# EAGLE design OpenEVSE_PLUS_v6.5.1 (EAGLE 9.6.2)
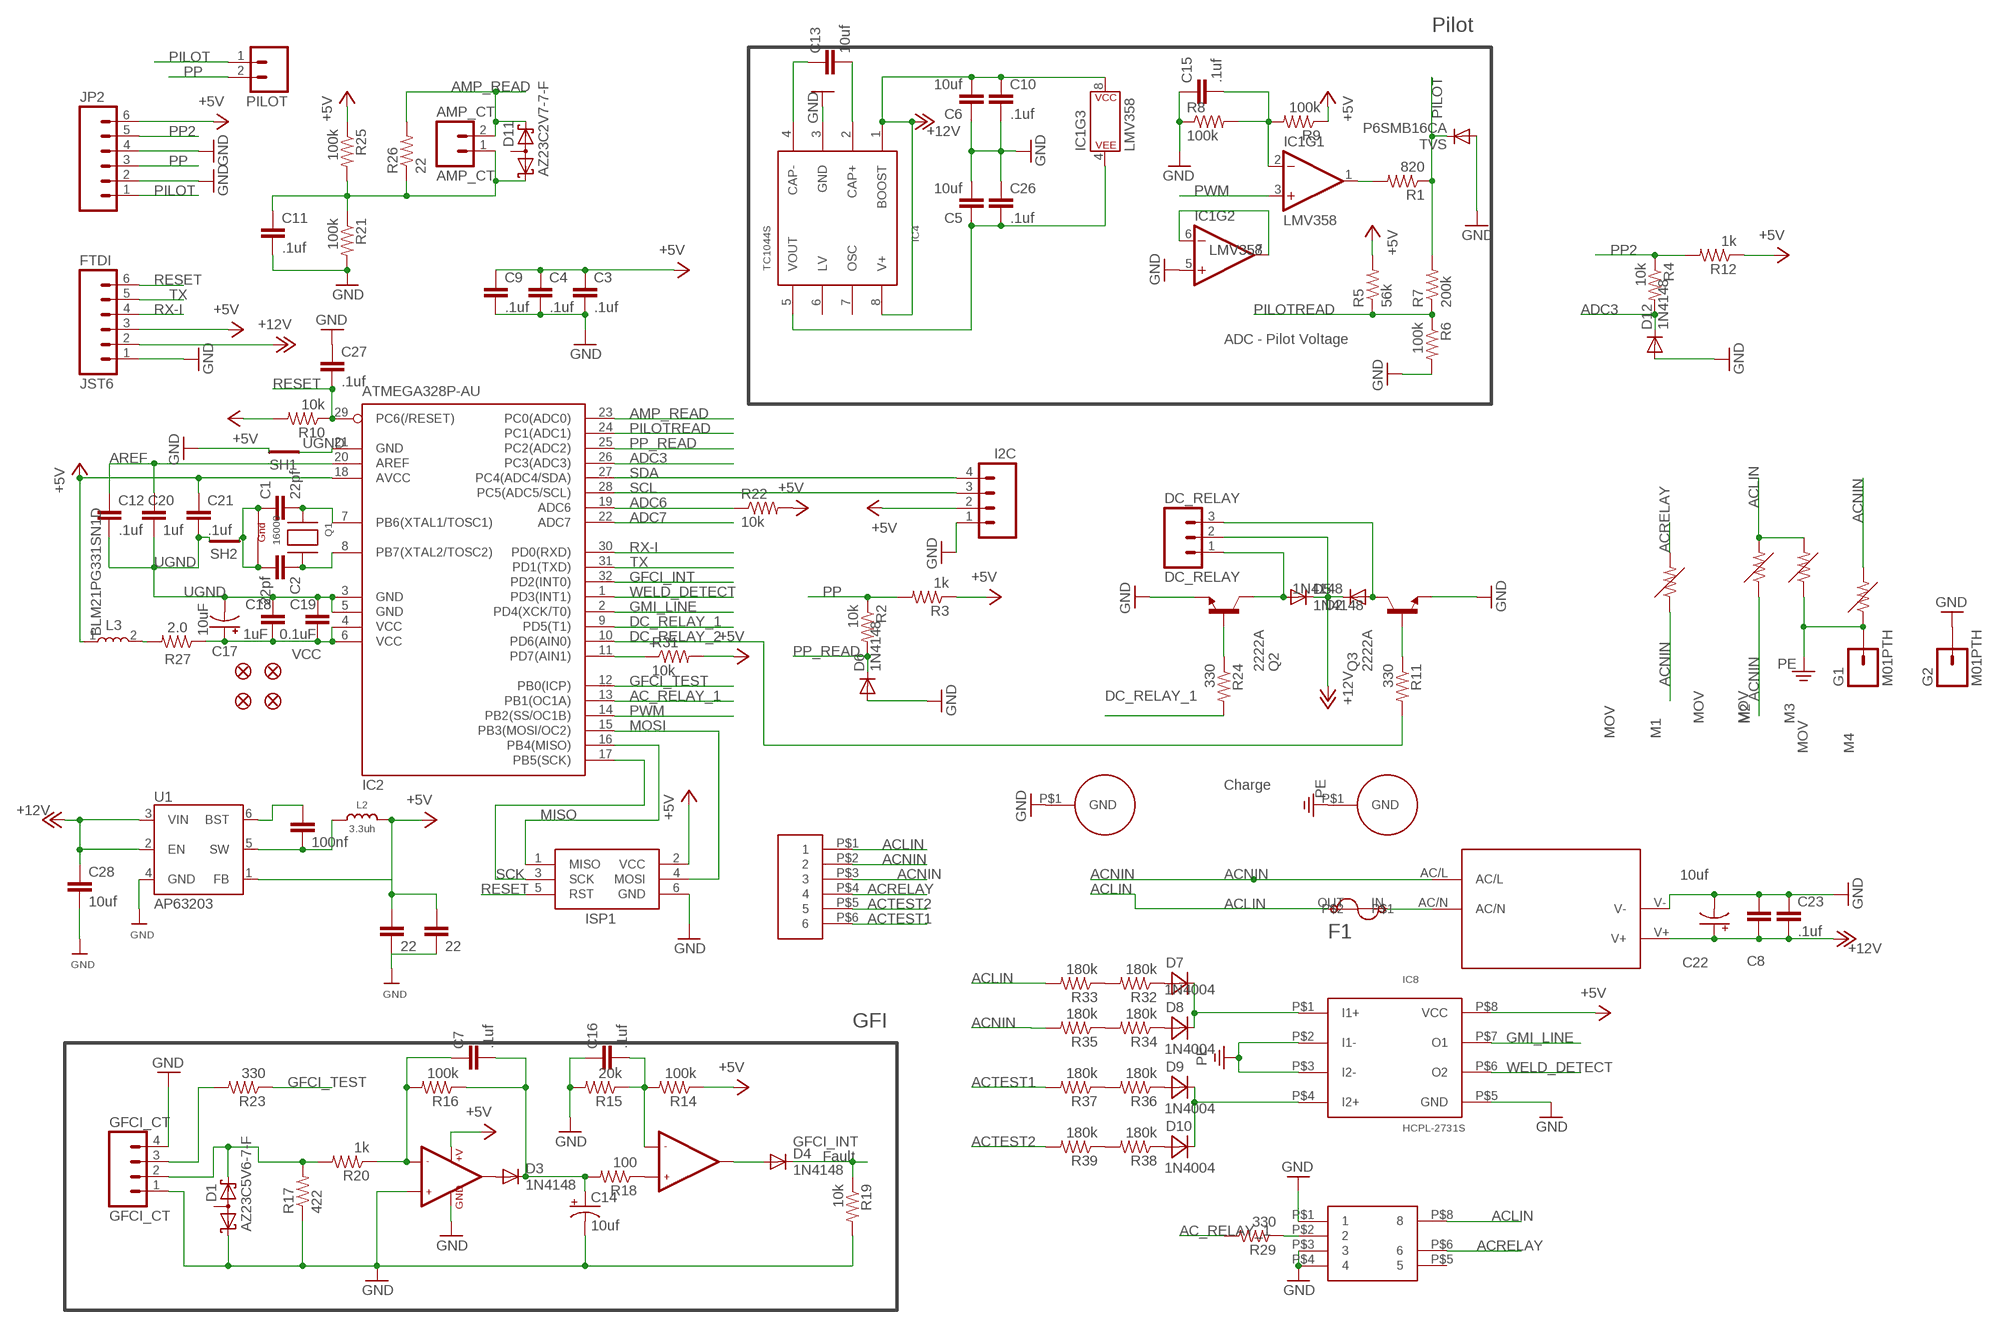
[diagram p0: schematic, sheet 1]

## Parts
AC  JST-VH-6  [JST-VH-6]
AMP_CT  AMP_CT  MOLEX_2  [MOLEX_2]
C1  22pf  CAP0805  [0805]
C2  22pf  CAP0805  [0805]
C3  .1uf  CAP0805  [0805]
C4  .1uf  CAP0805  [0805]
C5  10uf  CAP0805  [0805]
C6  10uf  CAP0805  [0805]
C7  .1uf  CAP0805  [0805]
C8  1uf  CAP0805  [0805]
C9  .1uf  CAP0805  [0805]
C10  .1uf  CAP0805  [0805]
C11  .1uf  CAP0805  [0805]
C12  .1uf  CAP0805  [0805]
C13  10uf  CAP0805  [0805]
C14  10uf  CAP_POL1206  [EIA3216]
C15  .1uf  CAP0805  [0805]
C16  .1uf  CAP0805  [0805]
C17  10uF  10UF-POLAR-0603-6.3V-20%(TANT)  [0603-POLAR]
C18  1uF  CAP0805  [0805]
C19  0.1uF  CAP0805  [0805]
C20  1uf  CAP0805  [0805]
C21  .1uf  CAP0805  [0805]
C22  10uf  CAP_POL1206  [EIA3216]
C23  .1uf  CAP0805  [0805]
C26  .1uf  CAP0805  [0805]
C27  .1uf  CAP0805  [0805]
C28  10uf  1.0UF-0805-25V-(+80/-20%)  [0805]
C29  22  1.0UF-0805-25V-(+80/-20%)  [0805]
C32  100nf  1.0UF-0805-25V-(+80/-20%)  [0805]
C33  22  1.0UF-0805-25V-(+80/-20%)  [0805]
D1  AZ23C5V6-7-F  BAS40-06  [SOT23]
D2  1N4148  DIODE-SOD123  [SOD123]
D3  1N4148  DIODE-SOD123  [SOD123]
D4  1N4148  DIODE-SOD123  [SOD123]
D5  1N4148  DIODE-SOD123  [SOD123]
D6  1N4148  DIODE-SOD123  [SOD123]
D7  1N4004  MBRA340T3  [SMA]
D8  1N4004  MBRA340T3  [SMA]
D9  1N4004  MBRA340T3  [SMA]
D10  1N4004  MBRA340T3  [SMA]
D11  AZ23C2V7-7-F  BAS40-06  [SOT23]
D12  1N4148  DIODE-SOD123  [SOD123]
DC_RELAY  DC_RELAY  MOLEX_3  [MOLEX_3]
F1  BEL1.6AFUSE  BEL1AFUSE  [BELFUSE1A]
FID1  FIDUCIAL1X2.5  [FIDUCIAL-1X2.5]
FID2  FIDUCIAL1X2.5  [FIDUCIAL-1X2.5]
FID3  FIDUCIAL1X2.5  [FIDUCIAL-1X2.5]
FID4  FIDUCIAL1X2.5  [FIDUCIAL-1X2.5]
FTDI  JST6  [JST6]
G1  M01PTH  [1X01]
G2  M01PTH  [1X01]
GFCI_CT  GFCI_CT  GFCI_4  [GFCI_4]
I2C  M04JST-PTH-VERT  [JST-4-PTH-VERT]
IC1  LMV358  LMV358SOIC  [SO08]
IC2  ATMEGA328P-AU  MEGA8-AI  [TQFP32-08]
IC3  LM358  LMV358  [SO08]
IC4  TC1044S  [SO-8]
IC7  AQH2223  [SIL8]
IC8  HCPL-2731S  [SIL8-2]
ISP1  ISP1  AVRISP-6  [AVRISP]
JP2  M06POLAR_LOCK  [MOLEX-1X6_LOCK]
L2  3.3uh  MICROBUILDER_INDUCTORNR5040  [MICROBUILDER_INDUCTOR_5X5MM_NR5040_NOTHERMALS]
L3  BLM21PG331SN1D  [INDC2012X87]
M1  MOV  [MOV]
M2  MOV  [MOV]
M3  MOV  [MOV]
M4  MOV  [MOV]
PILOT  M025MM  [SCREWTERMINAL-5MM-2]
PS1  IRM-10-5  [IRM-10-5]
Q1  16000  XTAL-4-3225  [NX3225]
Q2  2222A  BCX70SMD  [SOT23]
Q3  2222A  BCX70SMD  [SOT23]
R1  820  RESISTOR0805-RES  [0805]
R2  10k  RESISTOR0805-RES  [0805]
R3  1k  RESISTOR0805-RES  [0805]
R4  10k  RESISTOR0805-RES  [0805]
R5  56k  RESISTOR0805-RES  [0805]
R6  100k  RESISTOR0805-RES  [0805]
R7  200k  RESISTOR0805-RES  [0805]
R8  100k  RESISTOR0805-RES  [0805]
R9  100k  RESISTOR0805-RES  [0805]
R10  10k  RESISTOR0805-RES  [0805]
R11  330  RESISTOR0805-RES  [0805]
R12  1k  RESISTOR0805-RES  [0805]
R14  100k  RESISTOR0805-RES  [0805]
R15  20k  RESISTOR0805-RES  [0805]
R16  100k  RESISTOR0805-RES  [0805]
R17  422  RESISTOR0805-RES  [0805]
R18  100  RESISTOR0805-RES  [0805]
R19  10k  RESISTOR0805-RES  [0805]
R20  1k  RESISTOR0805-RES  [0805]
R21  100k  RESISTOR0805-RES  [0805]
R22  10k  RESISTOR0805-RES  [0805]
R23  330  RESISTOR0805-RES  [0805]
R24  330  RESISTOR0805-RES  [0805]
R25  100k  RESISTOR0805-RES  [0805]
R26  22  R-US_R1206  [R1206]
R27  2.0  RESISTOR0805-RES  [0805]
R29  330  RESISTOR0805-RES  [0805]
R31  10k  RESISTOR0805-RES  [0805]
R32  180k  0.1OHM-1/2W-1%(1210)  [1210]
R33  180k  0.1OHM-1/2W-1%(1210)  [1210]
R34  180k  0.1OHM-1/2W-1%(1210)  [1210]
R35  180k  0.1OHM-1/2W-1%(1210)  [1210]
R36  180k  0.1OHM-1/2W-1%(1210)  [1210]
R37  180k  0.1OHM-1/2W-1%(1210)  [1210]
R38  180k  0.1OHM-1/2W-1%(1210)  [1210]
R39  180k  0.1OHM-1/2W-1%(1210)  [1210]
SH1  SHORT-HT5  [SHORT_TOP-50]
SH2  SHORT-HT5  [SHORT_TOP-50]
TVS  P6SMB16CA  DIODE-SMB  [SMB]
U1  AP63203  [SOT23-6]
U$3  HOLE  [HOLE]
U$9  HOLE  [HOLE]

## Nets
+5V: C3.1 C4.1 C9.1 C21.1 C29.1 C33.1 FTDI.3 I2C.2 IC2.18(AVCC) IC3.8(+V) IC8.P$8(VCC) ISP1.2(VCC) JP2.6 L2.P$2 L3.1 R3.1 R5.2 R9.1 R10.2 R12.1 R14.1 R22.2 R25.1 R31.2 U1.1(FB)
+12V: C6.2 C8.1 C10.1 C22.A(+) C23.2 C28.1 D2.C D5.C DC_RELAY.2 FTDI.2 IC1.8(P$V+) IC4.1(BOOST) IC4.8(V+) PS1.V+ U1.2(EN) U1.3(VIN)
-12V1: C5.1 C26.2 IC1.4(P$V-) IC4.5(VOUT)
AC_RELAY_1: IC2.13(PB1(OC1A)) R29.2
ACLIN: AC.P$1 F1.OUT IC7.P$8 M2.P$2 M3.P$2 R33.2
ACNIN: AC.P$2 AC.P$3 M1.P$1 M2.P$1 M4.P$2 PS1.AC/L R35.2
ACRELAY: AC.P$4 IC7.P$6 M1.P$2
ACTEST1: AC.P$6 R37.2
ACTEST2: AC.P$5 R39.2
ADC3: D12.C IC2.26(PC3(ADC3)) R4.2
ADC6: IC2.19(ADC6) R22.1
ADC7: IC2.22(ADC7)
AMP_READ: AMP_CT.2 D11.2(K2) IC2.23(PC0(ADC0)) R26.2
AREF: C12.1 C20.1 IC2.20(AREF)
DAMP: L3.2 R27.2
DC_RELAY_1: IC2.9(PD5(T1)) R24.2
DC_RELAY_1_O: D5.A DC_RELAY.1 Q2.3(C)
DC_RELAY_1_T: Q2.1(B) R24.1
DC_RELAY_2: IC2.10(PD6(AIN0)) R11.2
DC_RELAY_2_O: D2.A DC_RELAY.3 Q3.3(C)
DC_RELAY_2_T: Q3.1(B) R11.1
GFCI_INT: D4.C IC2.32(PD2(INT0)) R19.1
GFCI_TEST: IC2.12(PB0(ICP)) R23.1
GFI_TEST_O: GFCI_CT.3 R23.2
GMI_LINE: IC2.2(PD4(XCK/T0)) IC8.P$7(O1)
GND: C3.2 C4.2 C5.2 C6.1 C8.2 C9.2 C10.2 C11.2 C14.C(-) C15.1 C16.1 C22.C(-) C23.1 C26.1 C27.1 C28.2 C29.2 C33.2 D1.1(K1) D6.A D12.A FTDI.1 G2.1 GFCI_CT.1 GFCI_CT.4 I2C.1 IC1.5(+IN) IC3.3(+IN1) IC3.4(GND) IC4.3(GND) IC7.P$1 IC7.P$3 IC7.P$4 IC8.P$5(GND) ISP1.6(GND) JP2.2 JP2.4 PS1.V- Q2.2(E) Q3.2(E) R6.2 R8.1 R15.2 R17.1 R19.2 R21.2 SH1.2 TVS.A U1.4(GND) U$9.P$1(GND)
MISO: IC2.16(PB4(MISO)) ISP1.1(MISO)
MOSI: IC2.15(PB3(MOSI/OC2)) ISP1.4(MOSI)
N$1: D9.C D10.C IC8.P$4(I2+)
N$2: D7.C D8.C IC8.P$1(I1+)
N$4: C1.2 IC2.7(PB6(XTAL1/TOSC1)) Q1.2(X1)
N$5: C2.1 IC2.8(PB7(XTAL2/TOSC2)) Q1.4(X2)
N$6: D7.A R32.1
N$7: AMP_CT.1 C11.1 D11.1(K1) R21.1 R25.2 R26.1
N$8: C7.1 IC3.2(-IN1) R16.2 R20.1
N$9: D8.A R34.1
N$10: C15.2 IC1.2(-IN) R8.2 R9.2
N$11: IC1.1(OUT) R1.2
N$12: IC2.11(PD7(AIN1)) R31.1
N$13: R32.2 R33.1
N$14: IC1.6(-IN) IC1.7(OUT)
N$15: C32.1 U1.6(BST)
N$16: C32.2 L2.P$1 U1.5(SW)
N$17: R34.2 R35.1
N$18: IC7.P$2 R29.1
N$19: C13.2 IC4.2(CAP+)
N$20: D1.2(K2) GFCI_CT.2 R17.2 R20.2
N$21: D3.A IC3.1(OUT1)
N$22: R36.2 R37.1
N$23: C7.2 C14.A(+) D3.C R16.1 R18.2
N$24: C16.2 IC3.6(-IN2) R14.2 R15.1
N$25: D4.A IC3.7(OUT2)
N$26: IC3.5(+IN2) R18.1
N$27: C13.1 IC4.4(CAP-)
N$28: R38.2 R39.1
N$29: D9.A R36.1
N$30: D10.A R38.1
N$31: F1.IN PS1.AC/N
PE: G1.1 IC8.P$2(I1-) IC8.P$3(I2-) M3.P$1 M4.P$1 U$3.P$1(GND)
PILOT: JP2.1 PILOT.1 R1.1 R7.2 TVS.C
PILOTREAD: IC2.24(PC1(ADC1)) R5.1 R6.1 R7.1
PP: JP2.3 PILOT.2 R2.1 R3.2
PP2: JP2.5 R4.1 R12.2
PP_READ: D6.C IC2.25(PC2(ADC2)) R2.2
PWM: IC1.3(+IN) IC2.14(PB2(SS/OC1B))
RESET: C27.2 FTDI.6 IC2.29(PC6(/RESET)) ISP1.5(RST) R10.1
RX-I: FTDI.4 IC2.30(PD0(RXD))
SCK: IC2.17(PB5(SCK)) ISP1.3(SCK)
SCL: I2C.3 IC2.28(PC5(ADC5/SCL))
SDA: I2C.4 IC2.27(PC4(ADC4/SDA))
TX: FTDI.5 IC2.31(PD1(TXD))
UGND: C12.2 C17.- C18.1 C19.1 C20.2 C21.2 IC2.3(GND) IC2.5(GND) IC2.21(GND) SH1.1 SH2.2
VCC: C17.+ C18.2 C19.2 IC2.4(VCC) IC2.6(VCC) R27.1
WELD_DETECT: IC2.1(PD3(INT1)) IC8.P$6(O2)
XGND: C1.1 C2.2 Q1.1(G1) Q1.3(G2) SH2.1
Unconnected: D1.3(AA) D11.3(AA) IC4.6(LV) IC4.7(OSC) IC7.P$5

## Notes on the sheet
- Pilot
- ADC - Pilot Voltage
- Charge
- GFI
- Fault

## Library data of the parts
AC = OpenEVSE:JST-VH-6
AMP_CT = OpenEVSE:MOLEX_2
C1-C13 C15 C16 C18-C21 C23 C26 C27 = SparkFun:CAP: Capacitor Standard 0603 ceramic capacitor, and 0.1" leaded capacitor.
C14 C22 = SparkFun:CAP_POL: Capacitor Polarized These are standard SMD and PTH capacitors. Normally 10uF, 47uF, and 100uF in electrolytic and tantalum varieties. Always verify the external diameter of the through hole cap, it varies with capacity, voltage, and manufacturer. The EIA devices should be standard.
C17 = SparkFun-Capacitors:10UF-POLAR: 10.0µF polarized capacitors A capacitor is a passive two-terminal electrical component used to store electrical energy temporarily in an electric field.; PROD_ID: CAP-13210
C28 C29 C32 C33 = SparkFun-Capacitors:1.0UF: 1µF ceramic capacitors A capacitor is a passive two-terminal electrical component used to store electrical energy temporarily in an electric field.; PROD_ID: CAP-11625; VALUE: 1.0uF
D1 D11 = diode:BAS40-06: Silicon Schottky Diodes General-purpose diode for high-speed switching
D2-D6 D12 TVS = diode:DIODE-: DIODE
D7-D10 = diode:MBRA340T3: Surface Mount Schottky Power Rectifier Source: http://www.onsemi.com/pub_link/Collateral/MBRA340T3-D.PDF
DC_RELAY = OpenEVSE:MOLEX_3
F1 = Qxd:BEL1AFUSE
FID1-FID4 = SparkFun-Retired:FIDUCIAL: Fiducial Alignment Points Various fiducial points for machine vision alignment.
FTDI = OpenEVSE:JST6
G1 G2 = SparkFun:M01: Header 1 Standard 1-pin 0.1" header. Use with straight break away headers (SKU : PRT-00116), right angle break away headers (PRT-00553), swiss pins (PRT-00743), machine pins (PRT-00117), and female headers (PRT-00115).
GFCI_CT = OpenEVSE:GFCI_4
I2C = SparkFun-Connectors:M04: Header 4 Standard 4-pin 0.1" header. Use with straight break away headers (SKU : PRT-00116), right angle break away headers (PRT-00553), swiss pins (PRT-00743), machine pins (PRT-00117), and female headers (PRT-00115). Molex polarized connector foot print use with SKU : PRT-08231 with associated crimp pins and housings. 1MM SMD Version SKU: PRT-10208
IC1 = SparkFun-IC-Amplifiers:LMV358: IC LMV358 DUAL OP AMP Jellybean rail-to-rail output op-amp SparkFun Products SparkFun PicoBoard <https://www.sparkfun.com/products/11888> (WIG-11888) SparkFun Vernier Interface Shield <https://www.sparkfun.com/products/12858> (DEV-12858) SparkFun Blynk Board - ESP8266 <https://www.sparkfun.com/products/13794> (WRL-13794) SparkFun Digital Sandbox <https://www.sparkfun.com/products/12651> (DEV-12651 RoHS); PROD_ID: IC-09657
IC2 = atmel:MEGA8: MICROCONTROLLER 8 Kbytes FLASH, 1 kbytes SRAM, 512 bytes EEPROM, USART, 6-channel 10 bit ADC, 2-channel 8 bit ADC Pin compatible with Atmega48, ATMega88, ATMega168 Source: avr.lbr; MPN: ATMEGA8-16AU; OC_FARNELL: 9171371; OC_NEWARK: 73M8863
IC3 = SparkFun:LMV358
IC4 = OpenEVSE:TC1044S
IC7 = OpenEVSE:AQH2223
IC8 = OpenEVSE:HCPL-2731S
ISP1 = adafruit:AVRISP: AVR ISP HEADER Standard 6 pin header for AVR programming
JP2 = SparkFun-Connectors:M06: Header 6 Standard 6-pin 0.1" header. Use with straight break away headers (SKU : PRT-00116), right angle break away headers (PRT-00553), swiss pins (PRT-00743), machine pins (PRT-00117), and female headers (PRT-00115). Molex polarized connector foot print use with SKU : PRT-08094 with associated crimp pins and housings. NOTES ON THE VARIANTS LOCK and LOCK_LONGPADS... This footprint was designed to help hold the alignment of a through-hole component (i.e. 6-pin header) while soldering it into place. You may notice that each hole has been shifted either up or down by 0.005 of an inch from it's more standard position (which is a perfectly straight line). This slight alteration caused the pins (the squares in the middle) to touch the edges of the holes. Because they are alternating, it causes a "brace" to hold the component in place. 0.005 has proven to be the perfect amount of "off-center" position when using our standard breakaway headers. Although looks a little odd when you look at the bare footprint, once you have a header in there, the alteration is very hard to notice. Also,if you push a header all the way into place, it is covered up entirely on the bottom side. This idea of altering the position of holes to aid alignment will be further integrated into the Sparkfun Library for other footprints. It can help hold any component with 3 or more connection pins.
L2 = ESP32_v1_SMPS:MICROBUILDER_INDUCTOR: Inductors 0603: 10nH Ceramic Inductor - microwire antenna/RF (Digikey: 712-1434-2-ND) 0805: 560nH Ceramic Inductor - RF (Digikey: 553-1047-1-ND) 270nH Ceramic Inductor - Q = 40@250MHz, +-5%, 1 Ohm DC Resistance (Digikey: 535-10506-2-ND) 1007 (2518 Metric) SMT: 10µH 10% 250mOhm 820mA 1007 Inductor (Digikey: 587-2189-1-ND) 22µH 10% 500mOhm 580mA 1007 Inductor (Digikey: 587-2190-1-ND) 47µH 10% 950mOhm 420mA 1007 Inductor (Digikey: 587-2191-1-ND) 47µH 5% 100mOhm 1A 1008 Inductor (Digikey: 732-1816-1-ND) 5.0x5.0mm (Taiyo Yuden NR5040 Series) 6.8µH 20% 2.3A 64mOhm Inductor (Digikey: 587-2374-2-ND) 5.0x5.0mm (TDK VLC5045 Series) 4.7µH 20% 3.3A 34mOhm Inductor (Digikey: 445-6526-1-ND) 6.8µH 20% 2.7A 46mOhm Inductor (Digikey: 445-6527-1-ND) 6.0x6.0mm (TDK VLC6045 Series) 4.7µH 20% 3.8A 27mOhm Inductor (Digikey: 445-6538-2-ND) 6.8µH 20% 3A 41mOhm Inductor (Digikey: 445-6540-1-ND) 6.2µH 30% 2.2A 45mOhm Inductor (Digikey: SRR5028-6R2YCT-ND) - Not TDK VLC6045 but footprint should match 6.0x6.0mm (TDK SLF6045 Series) 6.8uH 30% 2A 33mOhm Inductor (Digikey: 445-4572-1-ND, Mouser: 810-SLF645T6R8N2R0PF) 6.0x6.0mm (Sumida CDRH5D28 Series) 6.2uH 30% 1.8A 45mOhm Inductor (Digikey: 308-1542-1-ND) Taiyo Yuden NR3015T2R2M - 2.2uH 20% 1.5A (Digikey: 587-1648-2-ND, Mouser: 963-NR3015T2R2M) - Used with TI TPS62172 CoilCraft RFID Transponder Coil - MA5532-AE (For use with AS3935 Lightning Sensor)
L3 = BLM21PG331SN1D:BLM21PG331SN1D: Ferrite Beads Multi-Layer 330Ohm 25% 100MHz 1.5A 70mOhm DCR 0805 Paper T/R; DESCRIPTION: Ferrite Beads Multi-Layer 330Ohm 25% 100MHz 1.5A 70mOhm DCR 0805 Paper T/R; MF: Murata; MP: BLM21PG331SN1D; PACKAGE: 0805 Murata
M1-M4 = OpenEVSE:MOV
PILOT = SparkFun-Connectors:M02: Standard 2-pin 0.1" header. Use with - straight break away headers ( PRT-00116) - right angle break away headers (PRT-00553) - swiss pins (PRT-00743) - machine pins (PRT-00117) - female headers (PRT-00115) Molex polarized connector foot print use with: PRT-08233 with associated crimp pins and housings. 2.54_SCREWTERM for use with PRT-10571. 3.5mm Screw Terminal footprints for PRT-08084 5mm Screw Terminal footprints for use with PRT-08432; STOREFRONT_ID: PRT-08432
PS1 = OpenEVSE:IRM-10-5
Q1 = adafruit:XTAL-4: Classic 4-pin 3.2 x 2.5mm crystal
Q2 Q3 = transistor-npn:BCX70*: NPN Transistor
R1-R12 R14-R25 R27 R29 R31 = SparkFun:RESISTOR: Resistor Basic schematic elements and footprints for 0603, 1206, and PTH resistors.
R26 = rcl:R-US_: RESISTOR, American symbol
R32-R39 = SparkFun-Resistors:0.1OHM-1/2W-1%(1210); PROD_ID: RES-12374
SH1 SH2 = shorts-old:SHORT-H: Short between two nets; BOM: no
U1 = SparkFun-IC-Power:AP63203: Diodes Inc. AP63203 3.8V-32V input 3.3V Buck The AP63200/AP63201/AP63203/AP63205 is a 2A, synchronous buck converter with a wide input voltage range of 3.8V to 32V and fully integrates a 125mΩ high-side power MOSFET and a 68mΩ lowside power MOSFET to provide high-efficiency step-down DC/DC conversion; PROD_ID: VREG-15244
U$3 U$9 = OpenEVSE:HOLE

## Board
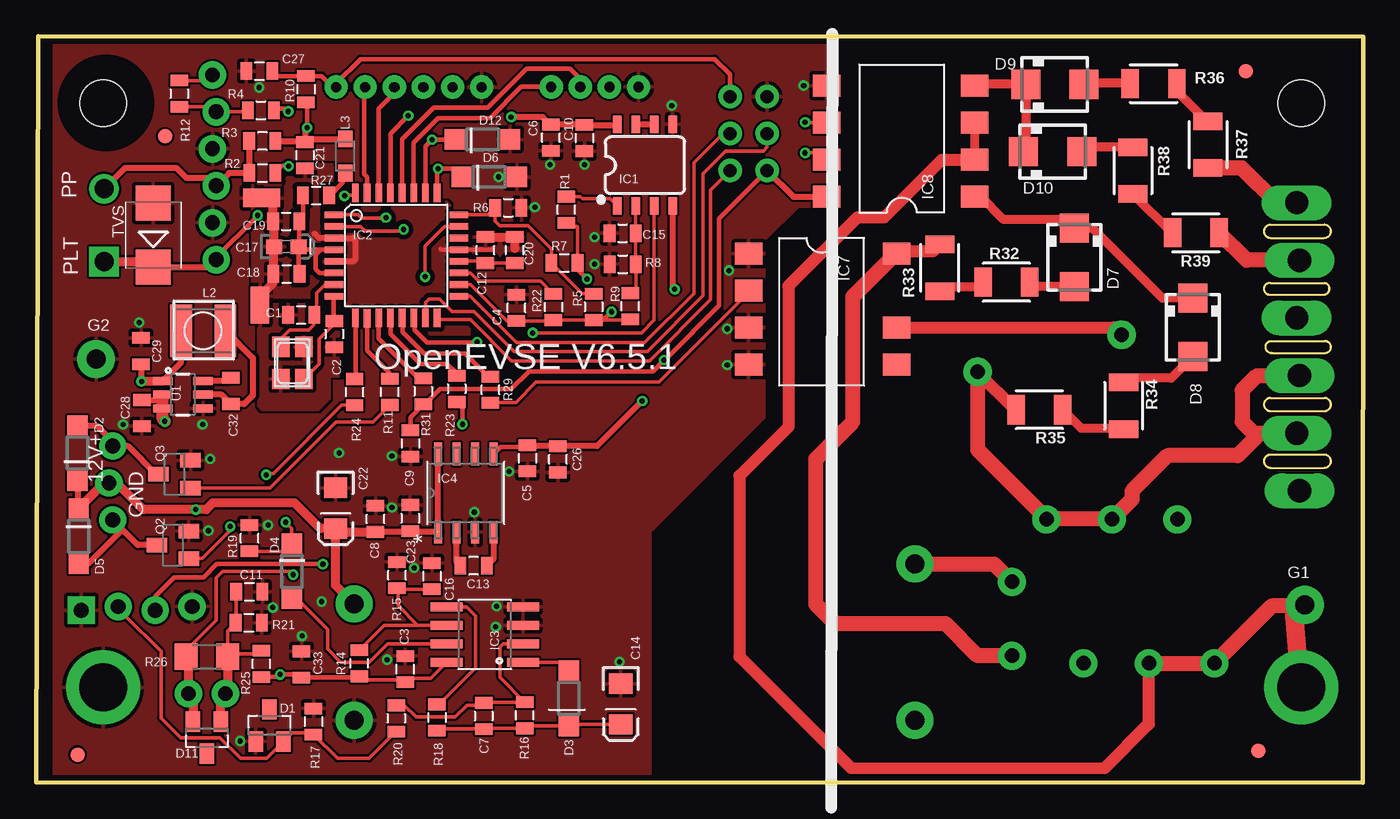
[diagram p1: board, top side]
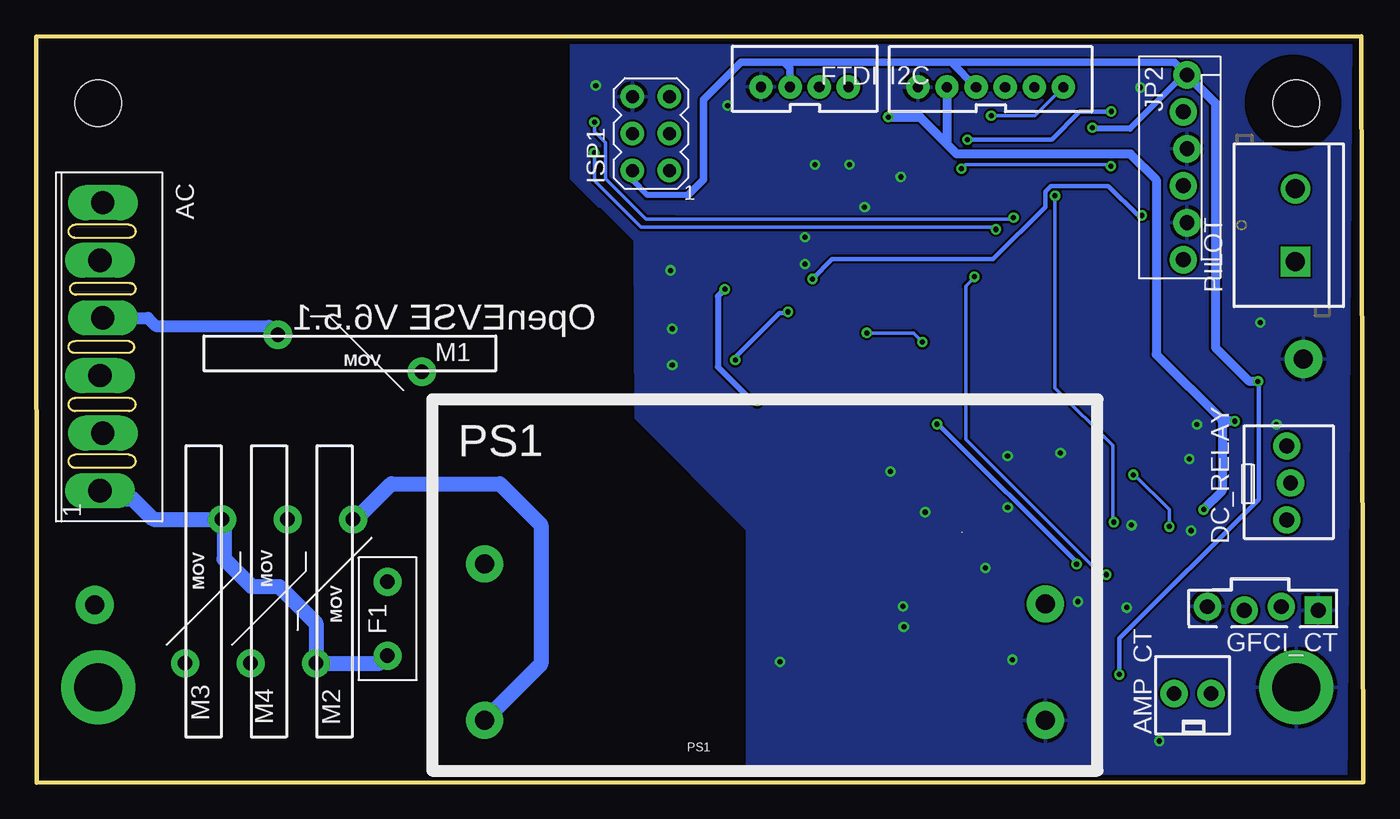
[diagram p2: board, bottom side, seen from below]

Size 91.14 x 51.27 mm. Coordinates in mm from the lower left corner, seen from the top.
Outline: 91.14,51.24 91.11,0 0,0.02 0.13,51.27 91.14,51.24
Copper layers (1*16): Top 0.0356mm / dielectric 1.5011mm / Bottom 0.0356mm
Design rules "default": minimum track width 6mil, minimum drill 13mil, track to track 6mil, track to pad 6mil, pad to pad 6mil, via to via 6mil, smd to smd 6mil, copper to edge 15mil, drill to drill 6mil, minimum pad ring 7mil, minimum via ring 7mil, stop-mask expansion 4mil, vias tented up to drill 0mil, thermal gap 10mil
Holes 3.2 mm at 86.87,46.67 4.58,46.67
tRestrict: area 1.5,43.5 to 8,49.9
bRestrict: area 1.6,43.5 to 8,49.9

### Footprints (pad centres in the part's own frame; a part is rotated, then mirrored left to right if it is on the bottom)
JST-VH-6 = drill 1.6 pad 1.93 long: P$1 0,11.88; P$2 -0.2,7.92; P$3 0,3.96; P$4 -0.2,0; P$5 0,-3.96; P$6 -0.2,-7.92
MOLEX_2 = drill 1.016 pad 1.88: 1 -1.27,0; 2 1.27,0
0805 = smd 0.8 x 1.2: 1 -0.9,0; 2 0.9,0
EIA3216 = smd 1.4 x 1.6: A 1.4,0; C -1.4,0
0603-POLAR = smd 1.1 x 1: + 0.85,0; - -0.85,0
SOT23 = smd 1 x 1.4: 1 -0.95,-1.1; 2 0.95,-1.1; 3 0,1.1
SOD123 = smd 1.4 x 1.4: A 1.9,0; C -1.9,0
SMA = smd 2 x 2: A 2,0; C -2,0
MOLEX_3 = drill 1.016 pad 1.88: 1 -2.54,0.127; 2 0,-0.127; 3 2.54,0.127
BELFUSE1A = drill 1 pad 1.93: IN 2,1.66; OUT 2,6.74
FIDUCIAL-1X2.5 = smd 1 x 1: 1 0,0
JST6 = drill 0.7 pad 1.6: 1 -5,-0.28; 2 -3,-0.28; 3 -1,-0.28; 4 1,-0.28; 5 3,-0.28; 6 5,-0.28
1X01 = drill 1.31 pad 2.6: 1 0,0
GFCI_4 = drill 1.016 pad 1.88 square: 1 0,0.127 | drill 1.016 pad 1.88: 2 2.54,-0.127; 3 5.08,0.127; 4 7.62,-0.127
JST-4-PTH-VERT = drill 0.7 pad 1.6: 1 -3,-0.55; 2 -1,-0.55; 3 1,-0.55; 4 3,-0.55
SO08 = smd 0.6 x 1.2: 1 -1.905,-2.8; 2 -0.635,-2.8; 3 0.635,-2.8; 4 1.905,-2.8; 5 1.905,2.8; 6 0.635,2.8; 7 -0.635,2.8; 8 -1.905,2.8
TQFP32-08 = smd 1.27 x 0.457: 1 -4.293,2.8; 2 -4.293,2; 3 -4.293,1.2; 4 -4.293,0.4; 5 -4.293,-0.4; 6 -4.293,-1.2; 7 -4.293,-2; 8 -4.293,-2.8; 17 4.293,-2.8; 18 4.293,-2; 19 4.293,-1.2; 20 4.293,-0.4; 21 4.293,0.4; 22 4.293,1.2; 23 4.293,2; 24 4.293,2.8 | smd 0.457 x 1.27: 9 -2.8,-4.293; 10 -2,-4.318; 11 -1.2,-4.293; 12 -0.4,-4.293; 13 0.4,-4.293; 14 1.2,-4.293; 15 2,-4.293; 16 2.8,-4.293; 25 2.8,4.293; 26 2,4.293; 27 1.2,4.293; 28 0.4,4.293; 29 -0.4,4.293; 30 -1.2,4.293; 31 -2,4.293; 32 -2.8,4.293
SO08' = smd 0.61 x 2.21: 1 -1.905,-2.616; 2 -0.635,-2.616; 3 0.635,-2.616; 4 1.905,-2.616; 5 1.905,2.616; 6 0.635,2.616; 7 -0.635,2.616; 8 -1.905,2.616
SO-8 = smd 1.549 x 0.559: 1 -2.68,1.905; 2 -2.68,0.635; 3 -2.68,-0.635; 4 -2.68,-1.905; 5 2.68,-1.905; 6 2.68,-0.635; 7 2.68,0.635; 8 2.68,1.905
SIL8 = smd 1.5 x 1.9: P$1 -4,-5; P$2 -1.46,-5; P$3 1.08,-5; P$4 3.62,-5; P$5 3.62,5.16; P$6 1.08,5.16; P$8 -4,5.16
SIL8-2 = smd 1.5 x 1.9: P$1 -4,-5; P$2 -1.46,-5; P$3 1.08,-5; P$4 3.62,-5; P$5 3.62,5.16; P$6 1.08,5.16; P$7 -1.46,5.16; P$8 -4,5.16
AVRISP = drill 0.9 pad 1.626: 1 -1.27,2.54; 2 1.27,2.54; 3 -1.27,0; 4 1.27,0; 5 -1.27,-2.54; 6 1.27,-2.54
MOLEX-1X6_LOCK = drill 1.016 pad 1.88: 1 0,0; 2 2.54,-0.254; 3 5.08,0; 4 7.62,-0.254; 5 10.16,0; 6 12.7,-0.254
MICROBUILDER_INDUCTOR_5X5MM_NR5040_NOTHERMALS = smd 1.5 x 3.6: P$1 -1.55,0; P$2 1.5,0
INDC2012X87 = smd 1.15 x 1: 1 -1.175,0; 2 1.175,0
MOV = drill 1 pad 1.93: P$1 0,1.27; P$2 9.89,-1.27
SCREWTERMINAL-5MM-2 = drill 1.3 pad 2.032 square: 1 0,0 | drill 1.3 pad 2.032: 2 5,0
IRM-10-5 = drill 1.3 pad 2.54: AC/L 3.6,3.45; AC/N 3.6,14.2; V+ 42.1,11.45; V- 42.1,3.45
NX3225 = smd 1.4 x 1.2: 1 -1.1,0.8; 2 1.1,0.8; 3 1.1,-0.8; 4 -1.1,-0.8
R1206 = smd 1.6 x 1.803: 1 -1.422,0; 2 1.422,0
1210 = smd 1.2 x 2: 1 -1.6,0; 2 1.6,0
SHORT_TOP-50 = smd 1.27 x 1.27: 1 0.635,0; 2 -0.635,0
SMB = smd 2.4 x 2.4: A 2.2,0; C -2.2,0
SOT23-6 = smd 0.55 x 1.35: 1 -0.95,-1.375; 2 0,-1.375; 3 0.95,-1.375; 4 0.95,1.375; 5 0,1.375; 6 -0.95,1.375
HOLE = drill 3.302 pad 5.08: P$1 0,0

### Placement (x,y rotation side)
AC  86.77,31.92 180 bottom
AMP_CT  11.72,6.12 0 bottom
C1  18.19,32.12 0 top
C2  20.46,30.81 270 top
C3  25.34,7.8 90 top
C4  32.98,32.62 90 top
C5  33.74,22.28 270 top
C6  35.34,44.31 90 top
C7  30.72,4.57 270 top
C8  23.3,18.12 90 top
C9  25.69,23.29 270 top
C10  37.65,44.28 270 top
C11  14.63,13.11 0 top
C12  30.85,36.59 90 top
C13  30.03,14.89 180 top
C14  40.14,5.4 270 top
C15  40.27,37.75 0 top
C16  27.17,14.18 270 top
C17  17.17,36.82 0 top
C18  17.19,34.95 0 top
C19  17.16,38.56 0 top
C20  32.85,36.59 90 top
C21  18.46,43.1 270 top
C22  20.56,18.85 270 top
C23  25.69,18.17 270 top
C26  35.82,22.21 90 top
C27  15.32,48.88 0 top
C28  7.25,25.38 270 top
C29  7.19,29.65 90 top
C32  13.37,26.91 270 top
C33  18.22,8.11 90 top
D1  16.02,3.93 0 top
D2  2.83,22.63 90 top
D3  36.56,5.79 90 top
D4  17.55,14.52 270 top
D5  2.91,16.93 270 top
D6  31.11,41.61 0 top
D7  71.31,36.09 270 top
D8  79.45,31.28 270 top
D9  69.96,47.96 0 top
D10  69.81,43.34 0 top
D11  11.72,3.08 180 top
D12  30.64,44.18 0 top
DC_RELAY  5.11,20.58 90 bottom
F1  65.01,15.45 180 bottom
FID1  83.93,2.17 0 top
FID2  8.85,44.41 0 top
FID3  83.09,48.88 0 top
FID4  2.83,1.91 0 top
FTDI  25.58,48.06 0 bottom
G1  87.13,12.2 0 top
G2  4.1,29.09 0 top
GFCI_CT  3.08,11.96 180 bottom
I2C  38.36,48.34 0 bottom
IC1  41.8,42.43 0 top
IC2  24.72,36.21 0 top
IC3  LM358  [SO08']  30.8,10.17 90 top
IC4  29.5,19.9 90 top
IC7  53.93,32.34 270 top
IC8  59.44,44.25 90 top
ISP1  48.92,44.59 180 bottom
JP2  12.35,35.92 90 bottom
L2  11.44,31.05 180 top
L3  21.21,43.04 270 top
M1  64.66,29.49 180 bottom
M2  70.66,18.08 270 bottom
M3  79.65,8.19 90 bottom
M4  75.15,8.19 90 bottom
PILOT  4.65,35.79 90 bottom
PS1  63.94,0.82 0 bottom
Q1  17.58,28.83 90 top
Q2  9.37,16.32 90 top
Q3  9.49,21.18 90 top
R1  36.4,39.36 90 top
R2  15.52,41.88 0 top
R3  15.52,44.08 180 top
R4  15.42,46.19 0 top
R5  38.28,32.68 270 top
R6  32.41,39.49 0 top
R7  36.27,35.7 0 top
R8  40.28,35.62 0 top
R9  40.79,32.73 90 top
R10  18.52,47.64 270 top
R11  24.27,26.84 90 top
R12  9.81,47.33 270 top
R14  22.17,8.2 90 top
R15  24.78,14.25 90 top
R16  33.55,4.62 90 top
R17  19.04,4.19 270 top
R18  27.52,4.47 270 top
R19  14.64,16.79 90 top
R20  24.72,4.41 270 top
R21  14.59,10.98 0 top
R22  35.52,32.67 270 top
R23  28.87,27.05 270 top
R24  21.86,26.83 90 top
R25  15.46,8.15 90 top
R26  11.72,8.64 180 top
R27  19.21,40.34 0 top
R29  31.19,26.98 90 top
R31  26.57,26.88 270 top
R32  66.63,34.37 180 top
R33  62.06,35.36 90 top
R34  74.69,25.89 270 top
R35  68.9,25.61 180 top
R36  76.74,48.01 0 top
R37  80.47,43.82 270 top
R38  75.32,42.04 270 top
R39  79.64,37.78 0 top
SH1  15.48,40.16 0 top
SH2  15.37,32.8 270 top
TVS  8.03,37.62 90 top
U1  10.07,26.65 270 top
U$3  86.87,6.54 0 top
U$9  4.58,6.54 0 top

### Tracks (layer width: path | path; a pad name or v marks a point on that pad's centre or on a via)
+5V  (via drill 0.35)
  Top 0.254: R9.1 40.74,31.78 38.31,31.78 R5.2 R22.2 35.46,31.72 C4.1 32.33,31.72 29.84,34.21 IC2.18 | JP2.6 11.7,48.23 R12.1 | IC3.8 27.09,7.17 25.61,7.17 C3.1 25.19,7.05 22.42,7.05 | 22.42,7.05 22.16,7.05 | 22.42,7.05 R14.1
  Top 0.305: ISP1.2 46.89,38.75 46.89,32.76 43.31,29.18 43.28,29.18 v43.13,29.02 42.34,28.24 33.83,28.24 32.62,27.03 27.72,27.03 26.67,25.98 R31.2 25.69,25.1 C9.1 | v39.5,32.34 38.94,31.78 38.31,31.78 | R25.1 16.57,7.25 v16.75,7.42 18,7.42 C33.1 22,7.21 22.16,7.05 | v18.6,44.99 18.6,46.66 R10.2
  Top 0.406: ISP1.2 51.99,40.25 IC8.P$8 | C29.1 7.19,27.77 7.22,27.74 v7.22,27.57 | U1.1 9.94,28.85 L2.P$2 | v18.6,44.99 18.46,44.85 C21.1 | C21.1 18.67,44.22 L3.1 | C21.1 18.43,44.03 16.47,44.03 R3.1
  Top 0.61: U1.1 8.65,27.57 v7.22,27.57
  Bottom 0.305: v43.13,29.02 43.13,29.23 40.09,32.27 39.5,32.27 v39.5,32.34 | v16.75,7.42 16.75,9.89 7.17,19.46 7.17,27.52 v7.22,27.57
  Bottom 0.406: 46.36,40.37 49.19,40.37 50.19,41.38 ISP1.2 | JP2.6 12.3,48.62 16.01,44.91 18.52,44.91 v18.6,44.99
  Bottom 0.508: 46.36,40.37 45.29,41.44 45.29,46.92 42.73,49.49 39.78,49.49 | 39.78,49.49 39.36,49.06 I2C.2 | FTDI.3 28.29,49.49 | 39.78,49.49 28.29,49.49 | JP2.6 12.96,49.49 28.29,49.49
  Bottom 0.61: JP2.6 10.14,46.67 10.14,29.9 7.8,27.57 v7.22,27.57
+12V  (via drill 0.35)  (1 unrouted)
  Top 0.406: 27.54,17.22 27.5,17.18 | IC4.8 IC4.1 27.54,17.27 C23.2 23.35,17.27 C8.1 | v32.62,45.73 34.77,45.73 35.3,45.21 C6.2 37.62,45.21 C10.1 39.85,45.18 IC1.8 | D2.C 2.83,18.91 D5.C | C28.1 7.18,26.22 7.43,26.29 8.56,26.29 8.69,26.41 U1.2
  Top 0.61: D5.C 4.66,20.58 DC_RELAY.2 5.52,20.58 7.35,18.75 v10.95,18.75 11.67,18.75 12.12,19.21 17.74,19.21 19.49,17.45 C22.A | IC4.1 | PS1.V+ 20.56,13.55 C22.A | C22.A 20.79,17.22 C8.1
  Top 0.813: v8.82,24.82 8.69,24.95 U1.3 8.69,26.41
  Bottom 0.61: v10.95,18.75 10.98,18.75 9.68,20.05 9.68,24.82 v8.82,24.82 9.61,24.82 14.21,29.42 14.21,41.41 15.98,43.19 27.9,43.19 28.58,43.88 | FTDI.2 28.58,43.88 | 28.58,43.88 30.44,45.73 v32.62,45.73
-12V1  (via drill 0.35)
  Top 0.305: C5.1 33.61,23.06 31.88,23.06 IC4.5
  Top 0.406: v41.61,26.22 38.5,23.11 C26.2 33.66,23.11 33.61,23.06 | IC1.4 43.71,34.03 v43.85,33.89
  Bottom 0.406: v43.85,33.89 44.33,33.41 44.33,28.56 41.99,26.22 v41.61,26.22
AC_RELAY_1
  Top 0.305: IC2.13 25.15,31.89 25.15,30.94 26.63,29.47 29.45,29.47 31.03,27.88 R29.2
ACLIN
  Top 0.813: IC7.P$8 59.23,36.48 61.58,36.48 R33.2
  Top 1.016: IC7.P$8 59.05,36.34 56.09,33.38 56.09,24.77 53.55,22.23 53.55,12.25 54.9,10.9 62.47,10.9 64.65,8.71 F1.OUT
  Bottom 1.016: AC.P$1 86.22,19.49 84.51,19.49 83.11,18.08 M3.P$2 78.24,17.94 78.24,15.35 76.36,13.47 74.45,13.47 71.93,10.95 M2.P$2 67.54,8.19 F1.OUT
ACNIN
  Top 0.813: M1.P$1 67.27,25.61 R35.2
  Top 1.016: 84.06,24 82.51,22.46 77.69,22.46 75.25,20.02 75.25,19.45 M4.P$2 73.86,18.11 69.42,18.11 | AC.P$3 83.84,27.96 82.84,26.96 82.84,24.77 83.61,24 84.06,24 | 69.42,18.11 M2.P$1 | 84.06,24 AC.P$2 | M1.P$1 64.66,22.87 69.42,18.11
  Bottom 1.016: M2.P$1 69.21,18.08 66.76,20.53 59.29,20.53 56.47,17.71 56.47,8.14 PS1.AC/L
ACRELAY
  Top 0.813: IC7.P$6 74.05,31.26 M1.P$2
  Bottom 0.813: AC.P$4 83.48,31.92 82.94,31.38 75.16,31.38 M1.P$2
ACTEST1
  Top 1.016: AC.P$6 85.19,39.84 82.81,42.22 R37.2
ACTEST2
  Top 1.016: AC.P$5 83.13,35.88 R39.2
ADC3  (via drill 0.35)
  Top 0.305: v17.3,46.11 17.13,46.29 16.43,46.29 R4.2 | D12.C v27.18,44.18 26.72,43.71 IC2.26
  Bottom 0.305: v17.3,46.11 17.33,46.08 19.49,46.08 21.39,44.18 v27.18,44.18
ADC6
  Top 0.254: IC2.19 29.83,35.01 30.39,34.45 34.63,34.45 R22.1
AMP_READ  (via drill 0.35)
  Top 0.254: v26.7,34.75 26.7,36.86 28.05,38.21 IC2.23 | v17.63,14.28 17.41,14.51 12.81,14.51 12.35,14.05 12.35,11.13 10.37,9.15 10.37,8.72
  Top 0.61: 10.37,8.72 R26.2 10.32,8.64 10.42,8.54 10.42,6.14 AMP_CT.2 10.77,5.79 D11.2
  Bottom 0.254: v26.7,34.75 26.7,34.68 27.29,34.09 27.29,23.58 17.99,14.28 v17.63,14.28
AREF
  Top 0.254: C20.1 C12.1 | C12.1 | IC2.20 30.72,35.81 C12.1
DAMP
  Top 0.305: L3.2 21.05,41.7 21.05,41.22 20.17,40.34 R27.2
DC_RELAY_1
  Top 0.254: 21.92,27.79 R24.2
  Top 0.305: IC2.9 21.92,27.79
DC_RELAY_1_O
  Top 0.305: DC_RELAY.1 5.91,17.37
  Top 0.406: D5.A 3.57,15.03 5.91,17.37 | Q2.3 6.96,16.32 DC_RELAY.1
DC_RELAY_1_T  (via drill 0.35)
  Top 0.254: R24.1 20.97,25.93 16.29,21.24 15.88,21.24 v15.78,21.14 | v13.32,17.58 13.32,17.33 11.39,15.4 10.5,15.4 Q2.1
  Bottom 0.254: v15.78,21.14 15.7,21.14 13.32,18.75 v13.32,17.58
DC_RELAY_2
  Top 0.305: IC2.10 22.72,29.69 24.27,28.14 R11.2
DC_RELAY_2_O
  Top 0.406: Q3.3 8.24,21.18 6.31,23.12 DC_RELAY.3 5.24,23.43 4.14,24.53 D2.A
DC_RELAY_2_T
  Top 0.254: Q3.1 16.04,20.23 20.58,24.77 23.15,24.77 24.27,25.9 R11.1
GFCI_INT  (via drill 0.35)
  Top 0.254: IC2.32 21.79,40.37 21.16,40.37 v21.16,40.32 | v17.13,17.89 17.55,17.47 D4.C 17.41,16.42 17.39,16.32 16.95,15.89 R19.1
  Bottom 0.254: v21.16,40.32 21.16,27.11 17.2,23.15 17.2,17.89 v17.13,17.89
GFCI_TEST
  Top 0.305: IC2.12 24.34,31.9 24.34,30.82 26.4,28.76 28.23,28.76 28.87,28.12 R23.1
GFI_TEST_O  (via drill 0.35)
  Top 0.305: GFCI_CT.3 8.16,12.81 9.46,14.1 11.49,14.1 12.39,15.01 v19.68,15.01 | v29.27,24.62 29.27,25.75 R23.2
  Bottom 0.305: v19.68,15.01 19.68,15.11 29.17,24.59 29.24,24.59 v29.27,24.62
GMI_LINE  (via drill 0.35)
  Top 0.254: IC8.P$7 53.81,43.26 v52.81,43.26 | IC2.2 22.28,38.21 22.61,37.88 25.1,37.88 v25.23,38.01
  Bottom 0.254: v52.81,43.26 52.81,41.37 49.59,38.15 25.38,38.15 v25.23,38.01
GND  (via drill 0.35)
  other vias: 38.34,35.62 38.34,37.47 47.58,35.19 47.45,31.17 47.45,28.68 52.71,47.89 43.64,46.52 37.65,42.45 35.29,42.45 31.76,41.61 34.25,39.53 32.47,21.37 30.08,18.58 24.42,22.44 31.6,12.1 31.55,10.7 40.06,8.29 24.09,8.44 25.94,14.74 19.59,12.43 18.24,10.07 14,2.85 11.82,17.31 11.94,22.23 5.95,24.59 11.41,24.59 7.07,31.61 15.3,47.76 15.91,17.69 16.24,12.02 20.78,22.64 24.42,18.91
  pour Bottom: 0.86,51.82 54.36,51.75 54.36,41.49 52.47,39.6 52.34,39.59 50.02,37.27 49.96,25.04 42.27,17.36 42.27,-0.27 39.74,-2.81 1.18,-1.07
  pour Top (rank 3): 1.22,51.92 54.36,51.53 54.47,40.75 53.33,39.61 52.33,39.61 49.99,37.27 49.99,25.13 50.02,25.1 42.15,17.23 42.15,-2.01 1.22,-1.47
MISO
  Top 0.254: ISP1.1 46.3,40.7 46.3,33.17 42.11,28.98 32.65,28.98 29.82,31.81 27.52,31.81 IC2.16
MOSI
  Top 0.254: ISP1.4 50.19,43.66 49.93,43.39 47.34,43.39 45.79,41.84 45.79,33.45 41.97,29.63 32.81,29.63 30.07,32.37 28.56,32.37 27.69,33.23 26.98,33.23 26.72,32.97 IC2.15
N$1
  Top 0.61: IC8.P$4 64.54,47.98 67.94,47.98 D9.C 67.96,43.49 D10.C
N$2
  Top 0.61: IC8.P$1 64.86,40.25 66.43,38.69 70.71,38.69 D7.C 72.55,38.09 77.35,33.28 D8.C
N$4
  Top 0.254: IC2.7 19.83,34.21 19.24,33.62 19.24,32.28 C1.2 19.03,32.07 19.03,31.43 18.7,31.1 17.41,31.1 16.78,30.47 Q1.2
N$5
  Top 0.254: Q1.4 19.41,28.76 19.41,30.46 20.43,31.48 20.43,31.74
  Top 0.305: C2.1 20.43,31.74 IC2.8
N$6
  Top 0.61: D7.A 68.52,34.09 R32.1
N$7
  Top 0.254: R26.1 13.14,8.85 | 13.14,8.85 13.14,10.43 R21.1 13.73,11.02 C11.1 | R25.2 15.25,8.85 13.14,8.85
  Top 0.61: R26.1 13.14,6.27 AMP_CT.1 12.67,5.79 D11.1
N$8
  Top 0.254: 30.61,5.37 30.77,5.52 R16.2 31.86,7.21 31.86,9.28 31.83,9.3 32.06,9.54 IC3.2 | R20.1 25.26,5.31 26.07,4.5 28.76,4.5 29.57,5.32 30.7,5.32 30.86,5.47
  Top 0.305: 30.61,5.37 C7.1 30.86,5.47
N$9
  Top 0.61: R34.1 74.99,27.79 77.95,27.79 D8.A
N$10
  Top 0.254: R9.2 41.18,34.02 R8.2 41.17,35.63 C15.2 IC1.2
N$11
  Top 0.254: IC1.1 39.41,40.11 37.52,40.11 37.33,40.26 R1.2
N$12
  Top 0.305: IC2.11 23.52,30.49 26.23,27.78 R31.1
N$13
  Top 0.61: R33.1 62.34,34.04 64.7,34.04 R32.2
N$14
  Top 0.406: IC1.7 IC1.6
N$15
  Top 0.406: C32.1 13.16,27.6 U1.6
N$16
  Top 0.406: U1.5 12.72,26.65 C32.2 14.27,26.01 14.87,26.6 14.87,29.17 L2.P$1
N$17
  Top 0.61: R34.2 74.63,24.34 71.77,24.34 R35.1
N$18
  Top 0.254: IC7.P$2 48.93,33.66 42.78,27.5 34.34,27.5 32.95,26.12 31.23,26.12 R29.1
N$19
  Top 0.406: C13.2 28.86,15.16 IC4.2
N$20
  Top 0.254: R20.2 22.87,1.65 20.68,1.65 R17.2 18.92,3.41 17.55,3.41 D1.2 15.81,1.67 14.01,1.67 12.6,3.08 9.91,3.08 8.57,4.43 8.57,9 6.08,11.49 6.08,11.63 GFCI_CT.2
N$21
  Top 0.254: IC3.1 35.99,8.27 D3.A
N$22
  Top 0.61: R36.2 78.34,47.51 80.42,45.42 R37.1
N$23
  Top 0.254: C14.A 36.67,4 D3.C 33.72,3.89 R16.1 30.77,3.72 C7.2 27.62,3.67 R18.2
N$24
  Top 0.254: C16.2 24.84,13.28 | 24.84,13.28 R15.1 | IC3.6 26.75,10.81 26.19,10.81 | 24.84,13.28 24.84,12.16 26.19,10.81 | R14.2 23.88,10.81 26.19,10.81
N$25
  Top 0.254: IC3.7 24.11,9.54 22.84,8.26 20.91,8.26 20,9.18 20,10.52 17.9,12.62 D4.A
N$26
  Top 0.254: IC3.5 29.54,12.08 30.18,11.44 30.18,7.88 27.67,5.37 R18.1
N$27
  Top 0.406: IC4.4 31.4,15.36 C13.1
N$28
  Top 0.61: R39.1 77.98,37.78 R38.2
N$29
  Top 0.61: D9.A 72.06,48.06 75.09,48.06 R36.1
N$30
  Top 0.61: R38.1 75.29,43.67 72.14,43.67 D10.A
N$31
  Top 1.016: PS1.AC/N 65.79,15.02 F1.IN
PE
  Top 0.61: IC8.P$3 IC8.P$2
  Top 0.813: IC8.P$2 62.2,42.79 58.25,38.84 56.39,38.84 51.64,34.09 51.7,34.04 51.7,24.47 48.29,21.06 48.29,8.67 55.96,1 73.39,1 76.42,4.03 M4.P$1
  Top 1.016: G1.1 87.06,12.13 84.86,12.13 M3.P$1 M4.P$1
  Top 1.27: U$3.P$1 86.81,6.47 86.39,11.46 G1.1
PILOT  (via drill 0.35)
  Top 0.254: R7.2 37.17,38.2 R1.1
  Top 0.305: JP2.1 12.43,36 12.5,36 12.5,36.23 14.92,38.64 14.92,38.69 v15.2,38.97 | v37.83,34.6 37.17,35.26 R7.2
  Top 0.406: TVS.C 11.85,35.42 JP2.1
  Top 0.61: PILOT.1 7.66,35.79 TVS.C
  Bottom 0.305: v37.83,34.6 36.48,35.95 25.42,35.95 21.82,39.54 21.82,40.59 21.44,40.98 17.49,40.98 15.48,38.97 v15.2,38.97
PILOTREAD
  Top 0.254: IC2.24 31.03,39.01 R6.1 31.51,38.58 31.83,38.26 33.76,38.26 35.37,36.65 R7.1 37.49,33.58 R5.1
PP
  Top 0.406: PILOT.2 6.11,42.25 9.61,42.25 10.32,41.54 11.82,41.54 JP2.3 13.23,41.88 R2.1 R3.2
PP2
  Top 0.254: R12.2 12.01,46.43 JP2.5 14.42,46.08 R4.1
PP_READ  (via drill 0.35)
  Top 0.254: 29.13,41.69 D6.C | v17.33,42.35 17.25,42.43 16.97,42.43 R2.2
  Top 0.305: IC2.25 27.52,42.1 v27.59,42.17 28.65,42.17 29.13,41.69
  Bottom 0.254: v27.59,42.17 27.31,42.45 17.25,42.45 17.25,42.43 v17.33,42.35
PWM  (via drill 0.35)
  Top 0.254: IC1.3 42.44,31.77 41.56,30.89 v34.09,30.89
  Top 0.305: IC2.14 25.97,31.87 25.97,31.1 26.83,30.23 30.23,30.23 v30.27,30.27
  Bottom 0.254: v34.09,30.89 30.89,30.89 v30.27,30.27
RESET  (via drill 0.35)
  Top 0.305: C27.2 16.56,48.54 R10.1 19.61,48.54 20.36,47.78 FTDI.6 20.58,48.04 22.26,49.72 46.59,49.72 47.65,48.65 ISP1.5 | IC2.29 24.32,44.59 v25.55,45.82
  Bottom 0.254: v25.55,45.82 22.55,45.82 FTDI.6
RX-I
  Top 0.305: IC2.30 23.52,46.31 24.58,47.37 FTDI.4
SCK
  Top 0.254: ISP1.3 47.17,44.59 45.16,42.58 45.16,33.6 41.78,30.23 32.99,30.23 29.81,33.41 IC2.17
SCL
  Top 0.305: IC2.28 25.12,44.2 27.29,46.36 30.99,46.36 33.69,49.06 36.66,49.06 37.36,48.35 I2C.3
SDA
  Top 0.305: IC2.27 25.92,43.98 27.59,45.65 31.16,45.65 33.3,47.79 I2C.4
TX
  Top 0.305: IC2.31 22.72,41.58 22.51,41.79 22.51,47.71 FTDI.5
UGND
  Top 0.305: 27.77,36.63 27.79,36.61 IC2.21 31.27,36.61 31.35,36.69
  Top 0.406: 19.11,37.7 19.4,37.41 IC2.3 21.71,37.41 21.9,37.22 21.9,35.95 21.76,35.81 IC2.5
  Top 0.61: C12.2 C20.2 32.85,36.71 | SH2.2 16.29,34.35 C18.1 16.29,36.79 C17.- 16.32,38.5 C19.1 16.26,40.02 SH1.1
  pour Top (isolate 0.305, rank 2): 14.84,39.18 18.14,42.47 26.53,42.47 26.53,41.54 30.52,37.55 33.44,37.55 33.44,35.71 29.73,35.71 29.73,30.74 29.33,30.34 21.73,30.34 21.49,30.58 21.49,32.58 20.93,33.14 14.84,33.14
VCC
  Top 0.254: C18.2 18.03,34.95 18.02,34.96
  Top 0.305: R27.1 18.31,38.81 C19.2 18.06,36.86 C17.+ | C17.+ 18.02,34.96 | C17.+ 18.22,36.61 19.51,36.61 | 19.51,36.61 IC2.4 | IC2.6 19.46,35.01 19.18,35.29 19.18,36.28 19.51,36.61
WELD_DETECT  (via drill 0.35)
  Top 0.254: v52.81,45.38 52.85,45.33 IC8.P$6 | v24.01,38.82 23.96,38.77 22.33,38.77 22.09,39.01 IC2.1
  Bottom 0.254: v24.01,38.82 24.13,38.7 47.23,38.7 47.24,38.71 49.27,38.71 52.05,41.5 52.05,43.98 52.81,44.73 v52.81,45.38
XGND
  pour Top (isolate 0.254): 20.79,32.89 15.89,32.89 15.19,32.19 15.19,25.89 15.49,25.59 19.39,25.59 20.19,26.39 20.19,27.89 20.79,27.89

### Text on the board
tNames: _ | _ | PP | PLT | OpenEVSE V6.5.1 | _ | 12V+ | GND | _ | _
bNames: AC | OpenEVSE V6.5.1 | F1 | PS1